# Altium schematic sheet cpu_pwr.SchDoc: CPU Power and Bypass
size B; Engineer: Michael J. Kelly; Organization: CSB540otn - Outernet; Address1: AM335x Compute Board; Address2: (C) 2015; Address3: See us on the Web:; Address4: http://outernet.is; DocumentNumber: 8; Revision: V1.0; SheetNumber: 8; SheetTotal: 9
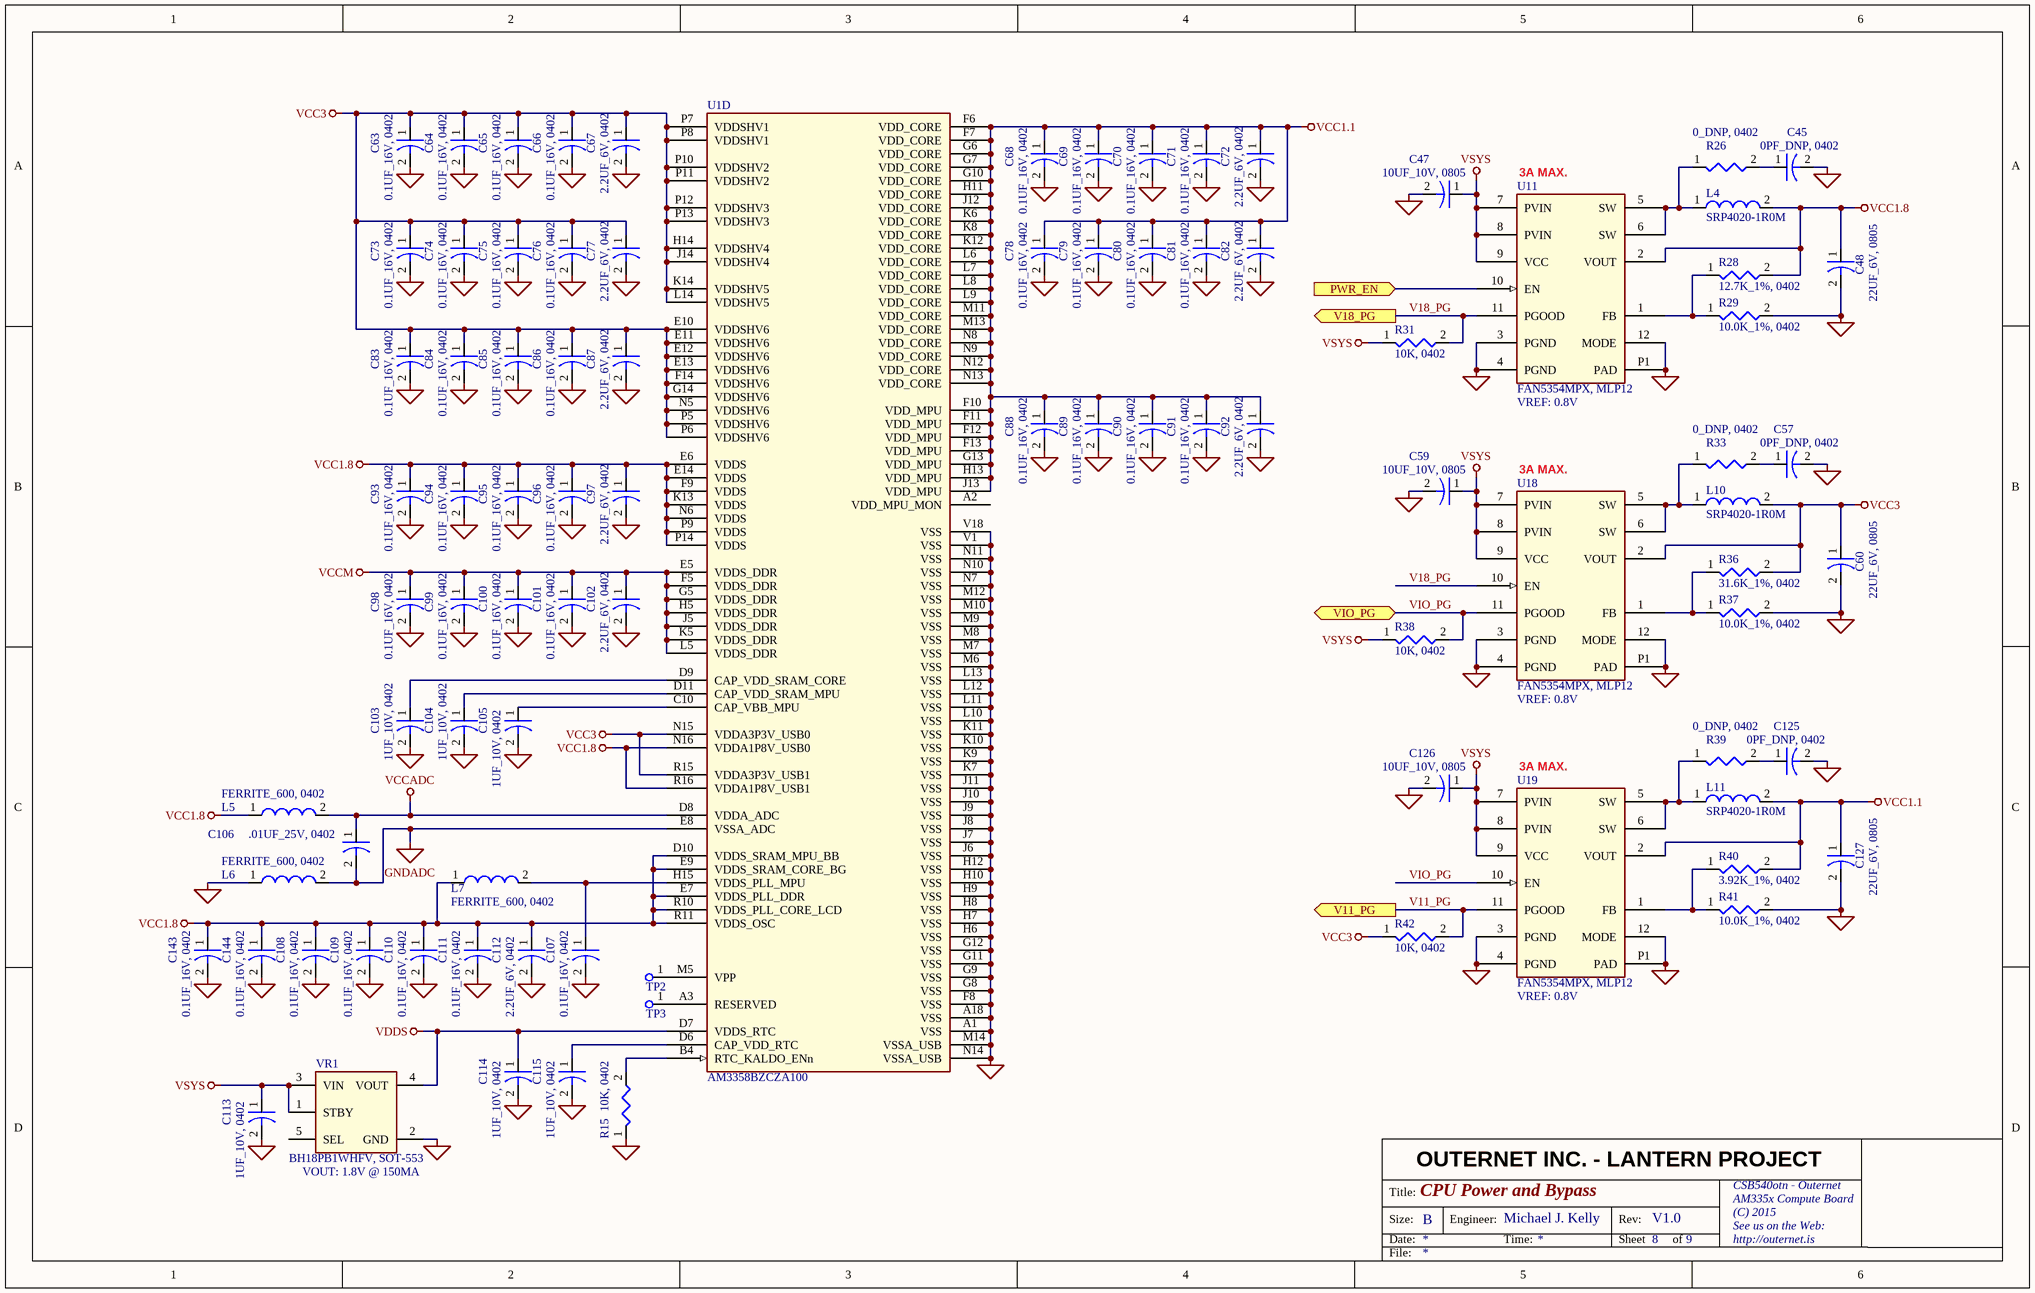
[diagram p0: cpu_pwr.SchDoc]

## Parts
C45  0PF_DNP, 0402  [0402C]
C47  10UF_10V, 0805  [0805C]
C48  22UF_6V, 0805  [0805C]
C57  0PF_DNP, 0402  [0402C]
C59  10UF_10V, 0805  [0805C]
C60  22UF_6V, 0805  [0805C]
C63  0.1UF_16V, 0402  [0402C]
C64  0.1UF_16V, 0402  [0402C]
C65  0.1UF_16V, 0402  [0402C]
C66  0.1UF_16V, 0402  [0402C]
C67  2.2UF_6V, 0402  [0402C]
C68  0.1UF_16V, 0402  [0402C]
C69  0.1UF_16V, 0402  [0402C]
C70  0.1UF_16V, 0402  [0402C]
C71  0.1UF_16V, 0402  [0402C]
C72  2.2UF_6V, 0402  [0402C]
C73  0.1UF_16V, 0402  [0402C]
C74  0.1UF_16V, 0402  [0402C]
C75  0.1UF_16V, 0402  [0402C]
C76  0.1UF_16V, 0402  [0402C]
C77  2.2UF_6V, 0402  [0402C]
C78  0.1UF_16V, 0402  [0402C]
C79  0.1UF_16V, 0402  [0402C]
C80  0.1UF_16V, 0402  [0402C]
C81  0.1UF_16V, 0402  [0402C]
C82  2.2UF_6V, 0402  [0402C]
C83  0.1UF_16V, 0402  [0402C]
C84  0.1UF_16V, 0402  [0402C]
C85  0.1UF_16V, 0402  [0402C]
C86  0.1UF_16V, 0402  [0402C]
C87  2.2UF_6V, 0402  [0402C]
C88  0.1UF_16V, 0402  [0402C]
C89  0.1UF_16V, 0402  [0402C]
C90  0.1UF_16V, 0402  [0402C]
C91  0.1UF_16V, 0402  [0402C]
C92  2.2UF_6V, 0402  [0402C]
C93  0.1UF_16V, 0402  [0402C]
C94  0.1UF_16V, 0402  [0402C]
C95  0.1UF_16V, 0402  [0402C]
C96  0.1UF_16V, 0402  [0402C]
C97  2.2UF_6V, 0402  [0402C]
C98  0.1UF_16V, 0402  [0402C]
C99  0.1UF_16V, 0402  [0402C]
C100  0.1UF_16V, 0402  [0402C]
C101  0.1UF_16V, 0402  [0402C]
C102  2.2UF_6V, 0402  [0402C]
C103  1UF_10V, 0402  [0402C]
C104  1UF_10V, 0402  [0402C]
C105  1UF_10V, 0402  [0402C]
C106  .01UF_25V, 0402  [0402C]
C107  0.1UF_16V, 0402  [0402C]
C108  0.1UF_16V, 0402  [0402C]
C109  0.1UF_16V, 0402  [0402C]
C110  0.1UF_16V, 0402  [0402C]
C111  0.1UF_16V, 0402  [0402C]
C112  2.2UF_6V, 0402  [0402C]
C113  1UF_10V, 0402  [0402C]
C114  1UF_10V, 0402  [0402C]
C115  1UF_10V, 0402  [0402C]
C125  0PF_DNP, 0402  [0402C]
C126  10UF_10V, 0805  [0805C]
C127  22UF_6V, 0805  [0805C]
C143  0.1UF_16V, 0402  [0402C]
C144  0.1UF_16V, 0402  [0402C]
L4  SRP4020-1R0M  [SRP4020]
L5  FERRITE_600, 0402  [0402L]
L6  FERRITE_600, 0402  [0402L]
L7  FERRITE_600, 0402  [0402L]
L10  SRP4020-1R0M  [SRP4020]
L11  SRP4020-1R0M  [SRP4020]
R15  10K, 0402  [0402R]
R26  0_DNP, 0402  [0402R]
R28  12.7K_1%, 0402  [0402R]
R29  10.0K_1%, 0402  [0402R]
R31  10K, 0402  [0402R]
R33  0_DNP, 0402  [0402R]
R36  31.6K_1%, 0402  [0402R]
R37  10.0K_1%, 0402  [0402R]
R38  10K, 0402  [0402R]
R39  0_DNP, 0402  [0402R]
R40  3.92K_1%, 0402  [0402R]
R41  10.0K_1%, 0402  [0402R]
R42  10K, 0402  [0402R]
TP2  TP20R  [TP_20R]  (value not drawn)
TP3  TP20R  [TP_20R]  (value not drawn)
U1  AM3358BZCZA100  [BGA324x18]  (part D of 4)
U11  FAN5354MPX, MLP12  VREF: 0.8V  [mlp12]
U18  FAN5354MPX, MLP12  VREF: 0.8V  [mlp12]
U19  FAN5354MPX, MLP12  VREF: 0.8V  [mlp12]
VR1  BH18PB1WHFV, SOT-553  VOUT: 1.8V @ 150MA  [SOT-553]

## Ports
PWR_EN (in), V11_PG (out), V18_PG (out), VIO_PG (bidir)

## Nets
GND: C45.2 C47.2 C48.2 C57.2 C59.2 C60.2 C63.2 C64.2 C65.2 C66.2 C67.2 C68.2 C69.2 C70.2 C71.2 C72.2 C73.2 C74.2 C75.2 C76.2 C77.2 C78.2 C79.2 C80.2 C81.2 C82.2 C83.2 C84.2 C85.2 C86.2 C87.2 C88.2 C89.2 C90.2 C91.2 C92.2 C93.2 C94.2 C95.2 C96.2 C97.2 C98.2 C99.2 C100.2 C101.2 C102.2 C103.2 C104.2 C105.2 C107.2 C108.2 C109.2 C110.2 C111.2 C112.2 C113.2 C114.2 C115.2 C125.2 C126.2 C127.2 C143.2 C144.2 L6.1 R15.1 R29.2 R37.2 R41.2 U1.A1(VSS) U1.A18(VSS) U1.F8(VSS) U1.G8(VSS) U1.G9(VSS) U1.G11(VSS) U1.G12(VSS) U1.H6(VSS) U1.H7(VSS) U1.H8(VSS) U1.H9(VSS) U1.H10(VSS) U1.H12(VSS) U1.J6(VSS) U1.J7(VSS) U1.J8(VSS) U1.J9(VSS) U1.J10(VSS) U1.J11(VSS) U1.K7(VSS) U1.K9(VSS) U1.K10(VSS) U1.K11(VSS) U1.L10(VSS) U1.L11(VSS) U1.L12(VSS) U1.L13(VSS) U1.M6(VSS) U1.M7(VSS) U1.M8(VSS) U1.M9(VSS) U1.M10(VSS) U1.M12(VSS) U1.M14(VSSA_USB) U1.N7(VSS) U1.N10(VSS) U1.N11(VSS) U1.N14(VSSA_USB) U1.V1(VSS) U1.V18(VSS) U11.3(PGND) U11.4(PGND) U11.12(MODE) U11.P1(PAD) U18.3(PGND) U18.4(PGND) U18.12(MODE) U18.P1(PAD) U19.3(PGND) U19.4(PGND) U19.12(MODE) U19.P1(PAD) VR1.2(GND)
GNDADC: C106.2 L6.2 U1.E8(VSSA_ADC)
VCC1.1: C68.1 C69.1 C70.1 C71.1 C72.1 C78.1 C79.1 C80.1 C81.1 C82.1 C88.1 C89.1 C90.1 C91.1 C92.1 C127.1 L11.2 R40.2 U1.F6(VDD_CORE) U1.F7(VDD_CORE) U1.F10(VDD_MPU) U1.F11(VDD_MPU) U1.F12(VDD_MPU) U1.F13(VDD_MPU) U1.G6(VDD_CORE) U1.G7(VDD_CORE) U1.G10(VDD_CORE) U1.G13(VDD_MPU) U1.H11(VDD_CORE) U1.H13(VDD_MPU) U1.J12(VDD_CORE) U1.J13(VDD_MPU) U1.K6(VDD_CORE) U1.K8(VDD_CORE) U1.K12(VDD_CORE) U1.L6(VDD_CORE) U1.L7(VDD_CORE) U1.L8(VDD_CORE) U1.L9(VDD_CORE) U1.M11(VDD_CORE) U1.M13(VDD_CORE) U1.N8(VDD_CORE) U1.N9(VDD_CORE) U1.N12(VDD_CORE) U1.N13(VDD_CORE) U19.2(VOUT)
VCC1.8: C48.1 C93.1 C94.1 C95.1 C96.1 C97.1 C108.1 C109.1 C110.1 C111.1 C112.1 C143.1 C144.1 L4.2 L5.1 L7.1 R28.2 U1.D10(VDDS_SRAM_MPU_BB) U1.E6(VDDS) U1.E7(VDDS_PLL_DDR) U1.E9(VDDS_SRAM_CORE_BG) U1.E14(VDDS) U1.F9(VDDS) U1.K13(VDDS) U1.N6(VDDS) U1.N16(VDDA1P8V_USB0) U1.P9(VDDS) U1.P14(VDDS) U1.R10(VDDS_PLL_CORE_LCD) U1.R11(VDDS_OSC) U1.R16(VDDA1P8V_USB1) U11.2(VOUT)
VCC3: C60.1 C63.1 C64.1 C65.1 C66.1 C67.1 C73.1 C74.1 C75.1 C76.1 C77.1 C83.1 C84.1 C85.1 C86.1 C87.1 L10.2 R36.2 R42.1 U1.E10(VDDSHV6) U1.E11(VDDSHV6) U1.E12(VDDSHV6) U1.E13(VDDSHV6) U1.F14(VDDSHV6) U1.G14(VDDSHV6) U1.H14(VDDSHV4) U1.J14(VDDSHV4) U1.K14(VDDSHV5) U1.L14(VDDSHV5) U1.N5(VDDSHV6) U1.N15(VDDA3P3V_USB0) U1.P5(VDDSHV6) U1.P6(VDDSHV6) U1.P7(VDDSHV1) U1.P8(VDDSHV1) U1.P10(VDDSHV2) U1.P11(VDDSHV2) U1.P12(VDDSHV3) U1.P13(VDDSHV3) U1.R15(VDDA3P3V_USB1) U18.2(VOUT)
VCCADC: C106.1 L5.2 U1.D8(VDDA_ADC)
VCCM: C98.1 C99.1 C100.1 C101.1 C102.1 U1.E5(VDDS_DDR) U1.F5(VDDS_DDR) U1.G5(VDDS_DDR) U1.H5(VDDS_DDR) U1.J5(VDDS_DDR) U1.K5(VDDS_DDR) U1.L5(VDDS_DDR)
VDDS: C114.1 U1.D7(VDDS_RTC) VR1.4(VOUT)
VSYS: C47.1 C59.1 C113.1 C126.1 R31.1 R38.1 U11.7(PVIN) U11.8(PVIN) U11.9(VCC) U18.7(PVIN) U18.8(PVIN) U18.9(VCC) U19.7(PVIN) U19.8(PVIN) U19.9(VCC) VR1.1(STBY) VR1.3(VIN)
PWR_EN: U11.10(EN) ; port PWR_EN
V11_PG: R42.2 U19.11(PGOOD) ; port V11_PG
V18_PG: R31.2 U11.11(PGOOD) U18.10(EN) ; port V18_PG
VIO_PG: R38.2 U18.11(PGOOD) U19.10(EN) ; port VIO_PG
NetC45_1: C45.1 R26.2
NetC57_1: C57.1 R33.2
NetC103_1: C103.1 U1.D9(CAP_VDD_SRAM_CORE)
NetC104_1: C104.1 U1.D11(CAP_VDD_SRAM_MPU)
NetC105_1: C105.1 U1.C10(CAP_VBB_MPU)
NetC107_1: C107.1 L7.2 U1.H15(VDDS_PLL_MPU)
NetC115_1: C115.1 U1.D6(CAP_VDD_RTC)
NetC125_1: C125.1 R39.2
NetL4_1: L4.1 R26.1 U11.5(SW) U11.6(SW)
NetL10_1: L10.1 R33.1 U18.5(SW) U18.6(SW)
NetL11_1: L11.1 R39.1 U19.5(SW) U19.6(SW)
NetR15_2: R15.2 U1.B4(RTC_KALDO_ENn)
NetR28_1: R28.1 R29.1 U11.1(FB)
NetR36_1: R36.1 R37.1 U18.1(FB)
NetR40_1: R40.1 R41.1 U19.1(FB)
NetTP2_1: TP2.1(TP) U1.M5(VPP)
NetTP3_1: TP3.1(TP) U1.A3(RESERVED)

Not connected (* = marked no-connect by the designer): U1 A2(VDD_MPU_MON); VR1 5(SEL)

## Notes on the sheet
- (near U11) 3A MAX.
- (near U18) 3A MAX.
- (near U19) 3A MAX.
- OUTERNET INC. - LANTERN PROJECT
- Title:
- Size:
- Date:
- B
- Engineer:
- Time:
- Rev:
- Sheet
- of
- File:

## Library data of the parts
C45 C57 C125 = 0PF_DNP, 0402: CAP - 0402 PKG
C47 C59 C126 = 10UF_10V, 0805: CAP - 0805 PKG
C48 C60 C127 = 22UF_6V, 0805: CAP - 0805 PKG
C63-C66 C68-C71 C73-C76 C78-C81 C83-C86 C88-C91 C93-C96 C98-C101 C107-C111 C143 C144 = 0.1UF_16V, 0402: CAP - 0402 PKG
C67 C72 C77 C82 C87 C92 C97 C102 C112 = 2.2UF_6V, 0402: CAP - 0402 PKG
C103-C105 C113-C115 = 1UF_10V, 0402: CAP - 0402 PKG
C106 = .01UF_25V, 0402: CAP - 0402 PKG
L4 L10 L11 = SRP4020-1R0M: INDUCTOR - 1.0UH, 5/6A, 4MM x 4MM x 2MM, 22mohm
L5-L7 = FERRITE_600, 0402: FERRITE BEAD - 600 OHM, 300MA, 0402 PKG
R15 R31 R38 R42 = 10K, 0402: RES - 0402 PKG
R26 R33 R39 = 0_DNP, 0402: RES - 0402 PKG, DO NOT POPULATE BY DEFAULT
R28 = 12.7K_1%, 0402: RES - 0402 PKG
R29 R37 R41 = 10.0K_1%, 0402: RES - 0402 PKG
R36 = 31.6K_1%, 0402: RES - 0402 PKG
R40 = 3.92K_1%, 0402: RES - 0402 PKG
TP2 TP3 = TP20R: MISC - TEST PAD, 20MIL ROUND
U1 = AM3358BZCZA100: MPU - CORTEX-A8 CORE, SDIO, GIGe, USB x2, UART x3, CAN, 2D/3D
U11 U18 U19 = FAN5354MPX, MLP12: SWITCHER - 270ua Iq, 3A, 2.7V TO 5.5V IN, 0.8V TO VIN OUT
VR1 = BH18PB1WHFV, SOT-553: LDO - 4ua Iq, 150ma, 3.4V - 5.5V IN, 1.8V OUT, 600mv Vdrop